# Altium schematic sheet Indicadores.SchDoc
size A4; SheetNumber: 6; SheetTotal: 6
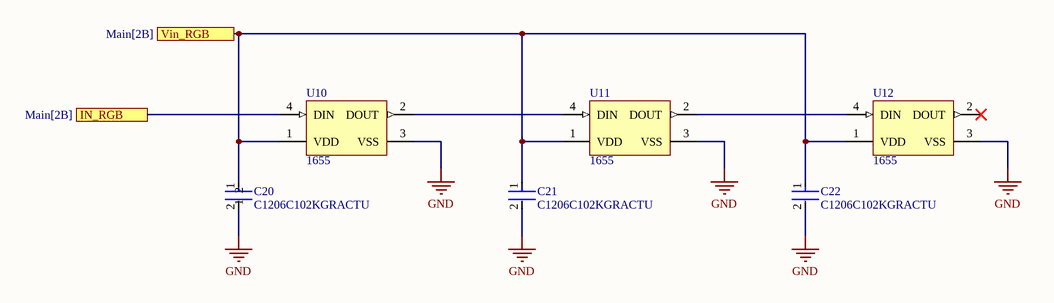
[diagram p0: Indicadores.SchDoc]

## Parts
C20  C1206C102KGRACTU  [FP-C1206C-EF-IPC_A]
C21  C1206C102KGRACTU  [FP-C1206C-EF-IPC_A]
C22  C1206C102KGRACTU  [FP-C1206C-EF-IPC_A]
U10  1655  [ADA-RGB-1655_V]
U11  1655  [ADA-RGB-1655_V]
U12  1655  [ADA-RGB-1655_V]

## Ports
IN_RGB (see Main[2B]), Vin_RGB (see Main[2B])

## Nets
GND: C20.2 C21.2 C22.2 U10.3(VSS) U11.3(VSS) U12.3(VSS)
IN_RGB: U10.4(DIN) ; port IN_RGB
Vin_RGB: C20.1 C21.1 C22.1 U10.1(VDD) U11.1(VDD) U12.1(VDD) ; port Vin_RGB
NetU10_2: U10.2(DOUT) U11.4(DIN)
NetU11_2: U11.2(DOUT) U12.4(DIN)

Not connected (* = marked no-connect by the designer): U12 2(DOUT)*

## Library data of the parts
C20-C22 = CMP-03020-034681-1: CAP CER 1000PF 2KV X7R 1206; Tolerance: 10%; Capacitance: 1nF; Dissipation Factor: 2.5%; Dielectric Material: Ceramic; Voltage Rating (DC): 2.5kV; Voltage: 2kV; REACH SVHC: No SVHC; Height: 1.6mm; Construction: Flat; Case/Package: 1206; Series: C; Mount: Surface Mount; RoHS Compliant: Yes; Package Quantity: 1; Length: 3.2mm; Width: 0.063inch; Voltage Rating: 2kV; Min Operating Temperature: -55°C; Case Code (Metric): 3216; Termination: SMD/SMT; Number of Pins: 2; Case Code (Imperial): 1206; Packaging: Tape and Reel; Dielectric: X7R; Thickness: 0.069inch; Depth: 1.6mm; Radiation Hardening: No; Max Operating Temperature: 125°C
U10-U12 = CMP-2000-05026-1: Intelligent Control LED Integrated Light Source, 3.5 to 5.3 V, -25 to 80 degC, 4-Pin SMD, RoHS, Tape and Reel; Manufacturer: Adafruit-Industries-LLC; Number of LEDs: 10; Configuration: Discrete; Utilized LED: WS2812(5050); Datasheet URL: http://datasheet.octopart.com/ADA1655-Adafruit-Industries-datasheet-32028139.pdf; Series: Neopixel; Interface: -; Package Description: 4-Pin Surface Mount Device, Body 5 x 5 mm; Color: Red,Green,Blue(RGB); Category: Optoelectronics; Controller Type: -; Package Reference: 1655; Manufacturer URL: https://www.adafruit.com/; Mounting Type: SurfaceMount; Datasheet Version: May-13; Size / Dimension: 5.00mmLx5.00mmW; Family: Addressable,Specialty